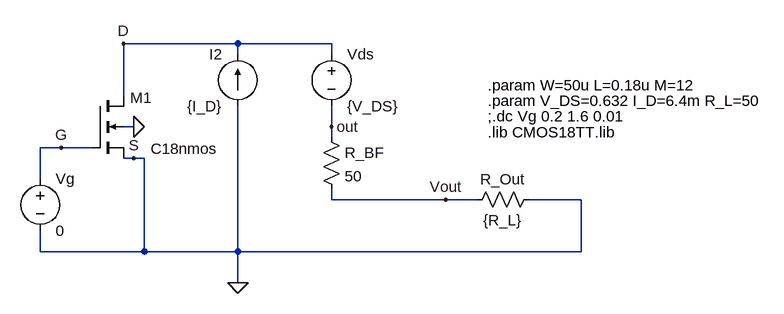
[diagram p0: schematic assignment1 - DriveCapability.asc]
assignment1 - DriveCapability.asc, the LTspice schematic file:
Version 4
SHEET 1 1336 680
WIRE 544 -128 368 -128
WIRE 688 -128 544 -128
WIRE 544 -112 544 -128
WIRE 688 -112 688 -128
WIRE 368 -48 368 -128
WIRE 384 0 368 0
WIRE 688 0 688 -32
WIRE 688 16 688 0
WIRE 272 32 240 32
WIRE 320 32 272 32
WIRE 384 48 368 48
WIRE 400 48 384 48
WIRE 240 80 240 32
WIRE 688 112 688 96
WIRE 864 112 688 112
WIRE 912 112 864 112
WIRE 1072 112 992 112
WIRE 240 192 240 160
WIRE 400 192 400 48
WIRE 400 192 240 192
WIRE 544 192 544 -32
WIRE 544 192 400 192
WIRE 1072 192 1072 112
WIRE 1072 192 544 192
WIRE 544 240 544 192
FLAG 544 240 0
FLAG 384 0 0
FLAG 272 32 G
FLAG 384 48 S
FLAG 368 -128 D
FLAG 688 0 out
FLAG 864 112 Vout
SYMBOL nmos4 320 -48 R0
WINDOW 3 90 82 Left 2
WINDOW 0 58 3 Left 2
SYMATTR Value C18nmos
SYMATTR InstName M1
SYMATTR Value2 l={L} w={W} m={M}
SYMBOL voltage 240 64 R0
SYMATTR InstName Vg
SYMATTR Value 0
SYMBOL voltage 688 -128 R0
SYMATTR InstName Vds
SYMATTR Value {V_DS}
SYMBOL current 544 -32 R180
WINDOW 0 24 80 Left 2
WINDOW 3 24 0 Left 2
SYMATTR InstName I2
SYMATTR Value {I_D}
SYMBOL res 672 0 R0
SYMATTR InstName R_BF
SYMATTR Value 50
SYMBOL res 1008 96 R90
WINDOW 0 0 56 VBottom 2
WINDOW 3 32 56 VTop 2
SYMATTR InstName R_Out
SYMATTR Value {R_L}
TEXT 928 -16 Left 2 !;.dc Vg 0.2 1.6 0.01
TEXT 928 -64 Left 2 !.param W=50u L=0.18u M=12
TEXT 928 -40 Left 2 !.param V_DS=0.632 I_D=6.4m R_L=50
TEXT 928 8 Left 2 !.lib CMOS18TT.lib

The netlist it stands for:
* assignment1 - DriveCapability.asc
M1 D G 0 0 C18nmos l={L} w={W} m={M}
Vg G 0 0
Vds D out {V_DS}
I2 0 D {I_D}
R_BF out Vout 50
R_Out 0 Vout {R_L}
.model NMOS NMOS
.model PMOS PMOS
.lib standard.mos
;.dc Vg 0.2 1.6 0.01
.param W=50u L=0.18u M=12
.param V_DS=0.632 I_D=6.4m R_L=50
.lib CMOS18TT.lib
.backanno
.end